# EasyEDA schematic Schéma-reflex.json
TITLE: schéma électrique maquette reflex; REV: 1.0; Date: 2026-03-18; Sheet: 1/1; Company: TERM CIEL
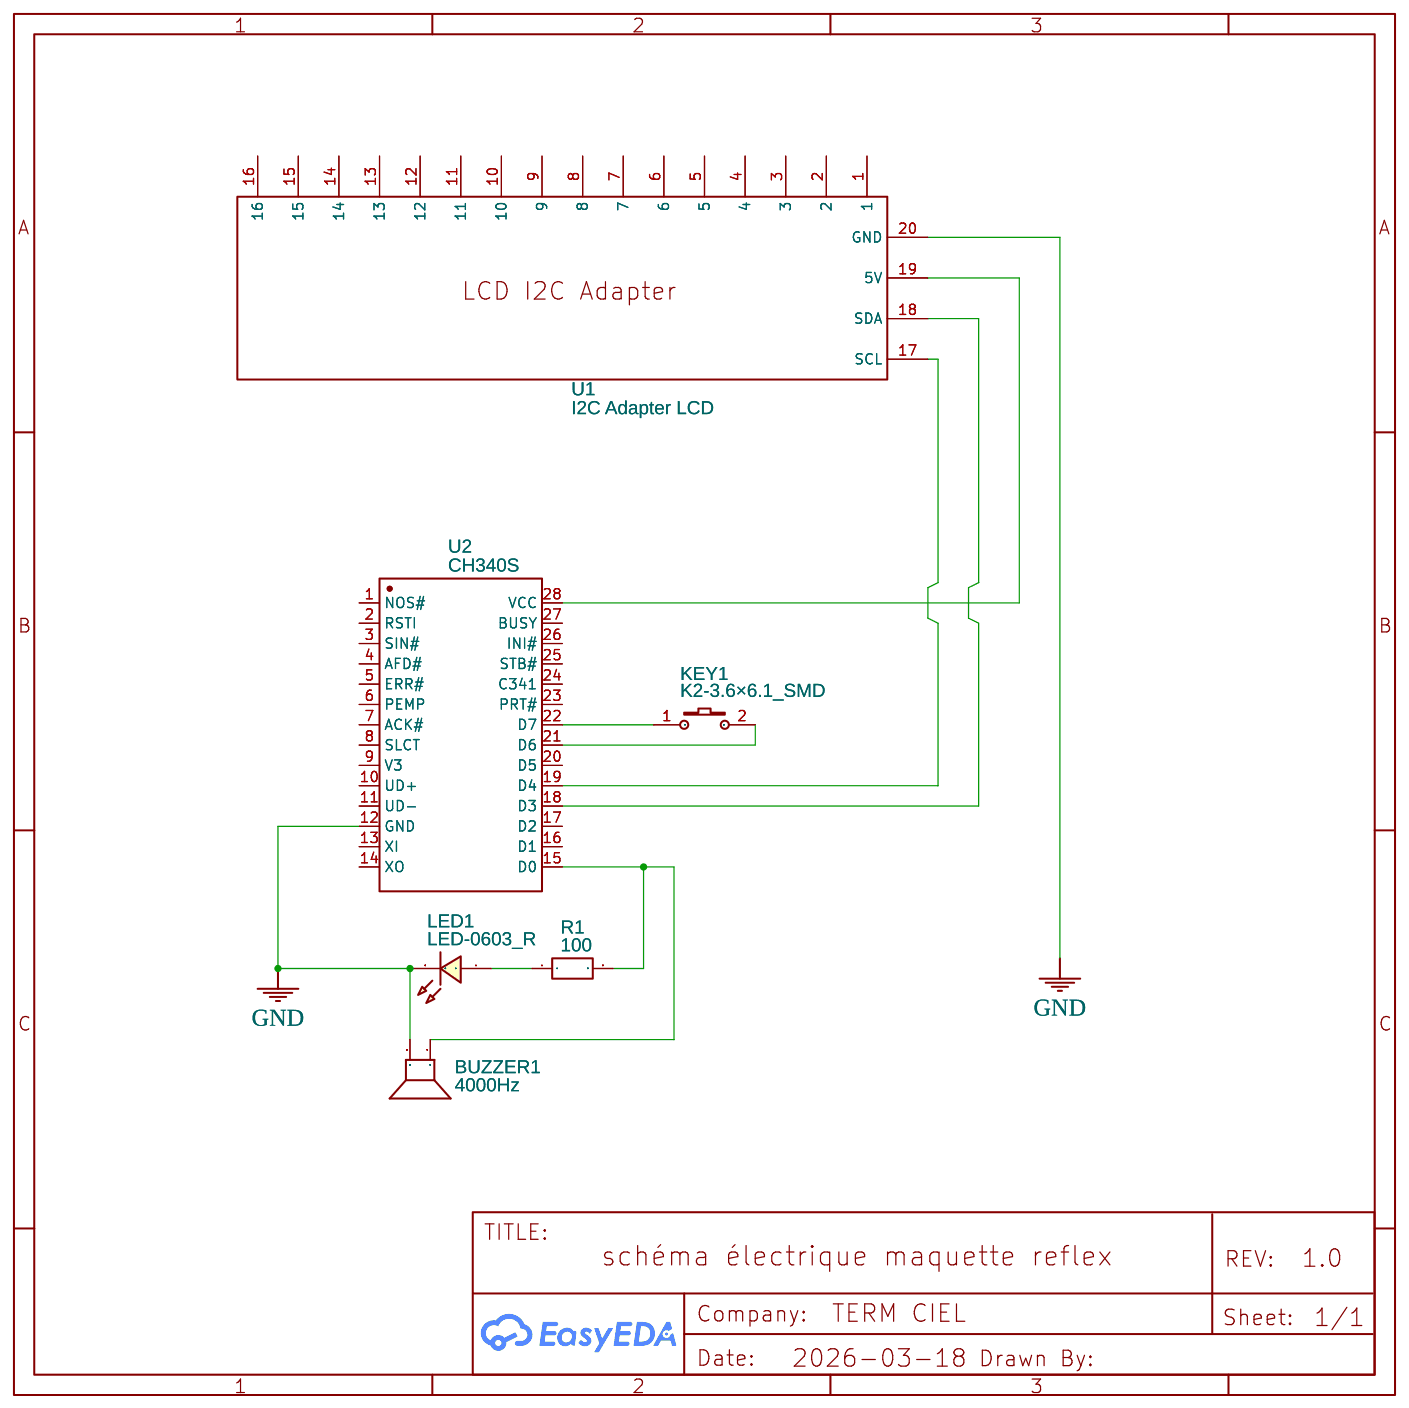
[diagram p0: schematic sheet]

## Parts
BUZZER1  4000Hz  [BUZ-TH_BD14.0-P7.60-D0.7]
KEY1  K2-3.6×6.1_SMD  [KEY-SMD_2P-L6.2-W3.6-LS8.0]
LED1  LED-0603_R  [LED0603_RED]
R1  100  [R0603]
U1  I2C Adapter LCD  [LCDI2CADAPTER]
U2  CH340S  [SOP-28_L17.9-W7.5-P1.27-LS10.3-BL]

## Library data of the parts
BUZZER1 = SFN-1407PA7.6: Contributor: LCSC; Supplier: LCSC; Supplier Part: C360603; Manufacturer: S&S(海旭); JLCPCB Part Class: Extended Part
KEY1 = K2-3.6×6.1_SMD: Supplier Part: C118141; Supplier: LCSC; Manufacturer Part: K2-1107ST-A4SW-06; Contributor: LCEDA_Lib; 制造商: 韩国韩荣
LED1 = LED-0603_R: Manufacturer: EVERLIGHT(台湾亿光); Manufacturer Part: 19-217/R6C-AL1M2VY/3T; Supplier Part: C72044; Supplier: LCSC; Contributor: LCEDA_01
R1 = R_0603_EU: Contributor: LCEDA_Lib
U1 = I2C Adapter LCD: Contributor: Dodger-j
U2 = CH340S: Contributor: LCSC; Supplier: LCSC; Manufacturer: WCH(南京沁恒); Supplier Part: C109467; JLCPCB Part Class: Extended Part

## Nets
GND: BUZZER1.2 LED1.2 U1.20(GND) U2.12(GND)
Net-(BUZZER1-1): BUZZER1.1 R1.2 U2.15(D0)
Net-(KEY1-1): KEY1.1 U2.22(D7)
Net-(KEY1-2): KEY1.2 U2.21(D6)
Net-(LED1-1): LED1.1 R1.1
Net-(U1-17): U1.17(SCL) U2.19(D4)
Net-(U1-18): U1.18(SDA) U2.18(D3)
Net-(U1-19): U1.19(5V) U2.28(VCC)

Not connected (* = marked no-connect by the designer): U1 1 2 3 4 5 6 7 8 9 10 11 12 13 14 15 16; U2 1(NOS#) 2(RSTI) 3(SIN#) 4(AFD#) 5(ERR#) 6(PEMP) 7(ACK#) 8(SLCT) 9(V3) 10(UD+) 11(UD-) 13(XI) 14(XO) 16(D1) 17(D2) 20(D5) 23(PRT#) 24(C341) 25(STB#) 26(INI#) 27(BUSY)
